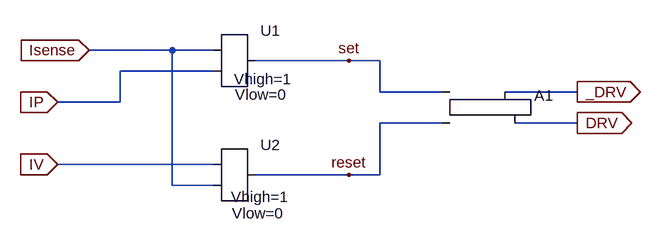
[diagram p0: schematic 2.- Hysteresis-controller-schematic.asc]
2.- Hysteresis-controller-schematic.asc, the LTspice schematic file:
Version 4
SHEET 1 972 852
WIRE 48 64 -80 64
WIRE 112 64 48 64
WIRE 320 80 176 80
WIRE 368 80 320 80
WIRE 112 96 -32 96
WIRE 368 128 368 80
WIRE 464 128 368 128
WIRE 672 128 560 128
WIRE -32 144 -32 96
WIRE -32 144 -128 144
WIRE 464 176 368 176
WIRE 672 176 576 176
WIRE 112 240 -128 240
WIRE 320 256 176 256
WIRE 368 256 368 176
WIRE 368 256 320 256
WIRE 48 272 48 64
WIRE 112 272 48 272
FLAG -80 64 Isense
IOPIN -80 64 In
FLAG 672 128 _DRV
IOPIN 672 128 Out
FLAG 320 80 set
FLAG 320 256 reset
FLAG 672 176 DRV
IOPIN 672 176 Out
FLAG -128 144 IP
IOPIN -128 144 In
FLAG -128 240 IV
IOPIN -128 240 In
SYMBOL Control\\comp 144 80 R0
WINDOW 3 -1 28 Left 2
WINDOW 123 1 52 Left 2
SYMATTR Value Vhigh=1
SYMATTR Value2 Vlow=0
SYMATTR InstName U1
SYMBOL Control\\comp 144 256 R0
WINDOW 3 -5 34 Left 2
WINDOW 123 -4 59 Left 2
SYMATTR Value Vhigh=1
SYMATTR Value2 Vlow=0
SYMATTR InstName U2
SYMBOL Digital\\srflop 512 80 R0
SYMATTR InstName A1

The netlist it stands for:
* 2.- Hysteresis-controller-schematic.asc
XU1 Isense IP set comp Vhigh=1 Vlow=0
XU2 IV Isense reset comp Vhigh=1 Vlow=0
A1 set reset 0 0 0 DRV _DRV 0 SRFLOP
.backanno
.end